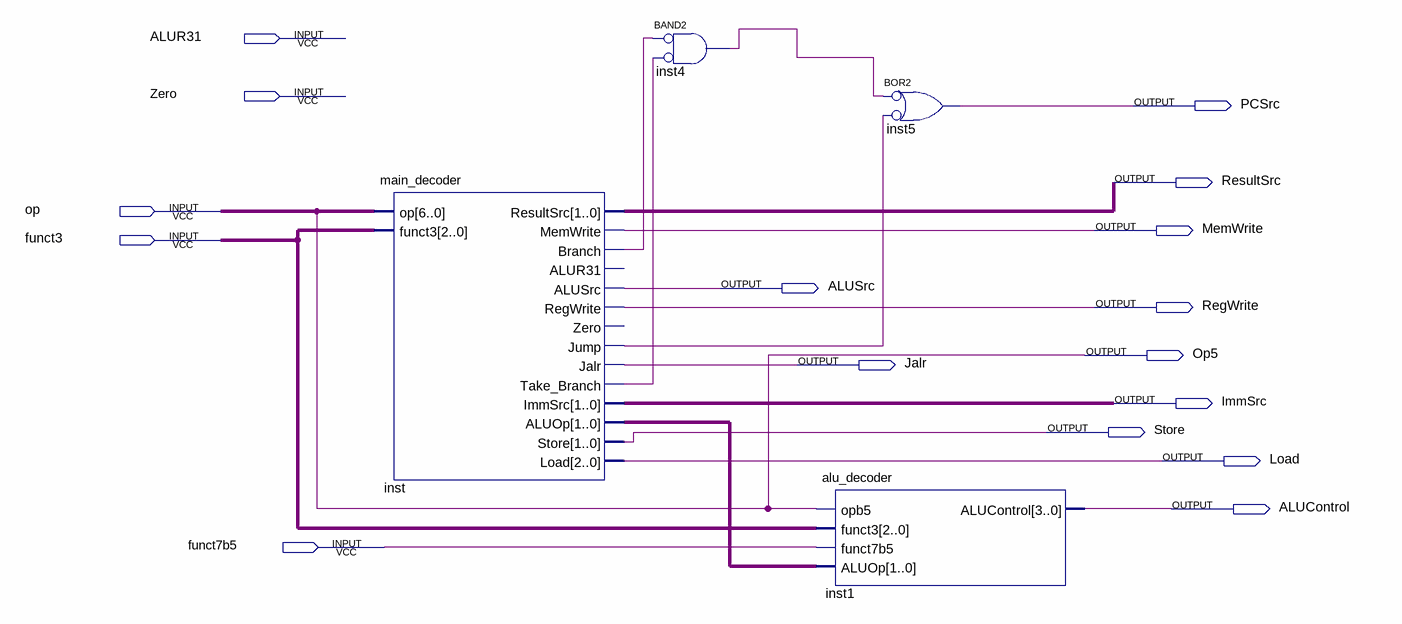
[diagram p0: schematic sheet]
// Quartus schematic controller.bdf as structural Verilog: 4 symbols, 16 pins
module controller (
  input  ALUR31,
  input  Zero,
  input  op,
  input  funct3,
  input  funct7b5,
  output PCSrc,
  output ResultSrc,
  output MemWrite,
  output ALUSrc,
  output RegWrite,
  output Op5,
  output Jalr,
  output ImmSrc,
  output Store,
  output Load,
  output ALUControl
);

  wire inst4_out, inst_branch, inst_jump, inst_take_branch;
  wire [1:0] inst_aluop, inst_immsrc, inst_resultsrc;
  wire [2:0] undriven;
  wire [6:0] undriven_2;

  main_decoder inst (
    .op(undriven_2), .funct3(undriven), .ResultSrc(inst_resultsrc), .MemWrite(MemWrite),
    .Branch(inst_branch), .ALUSrc(ALUSrc), .RegWrite(RegWrite), .Jump(inst_jump), .Jalr(Jalr),
    .Take_Branch(inst_take_branch), .ImmSrc(inst_immsrc), .ALUOp(inst_aluop), .Store(Store), .Load(Load));  // open: ALUR31, Zero
  and inst4 (inst4_out, ~inst_branch, ~inst_take_branch);  // BAND2
  alu_decoder inst1 (.opb5(Op5), .funct3(undriven), .funct7b5(funct7b5), .ALUOp(inst_aluop), .ALUControl(ALUControl));
  or inst5 (PCSrc, ~inst4_out, ~inst_jump);  // BOR2
endmodule
